# Altium schematic sheet LPCB235 - IO CONNECTOR.SchDoc
size A3; Address1: Unit 4; DocumentNumber: 15; Revision: 2; SheetNumber: 15; SheetTotal: 37; Lockie__PCB_SUB_ASSEMBLY: IO Connector; Lockie__PCB_ASSEMBLY: FCU PCB; Lockie__LDL: LPCB235; Lockie__PCB_DESCRIPTION: Flight Control Unit; PageSetup: Record=PageOptions|CenterHorizontal=True|CenterVertical=True|PrintScale=1.02|XCorrection=1.00|YCorrection=1.00|PrintKind=1|BorderSize=5000000|LeftOffset=0|BottomOffset=0|Orientation=2|PaperLength=4200|PaperWidth=2970|Scale=100|PaperSource=7|PrintQuality=-4|MediaType=1|DitherType=10|PaperKind=A3 (297 x 420 mm)|PrintScaleMode=1
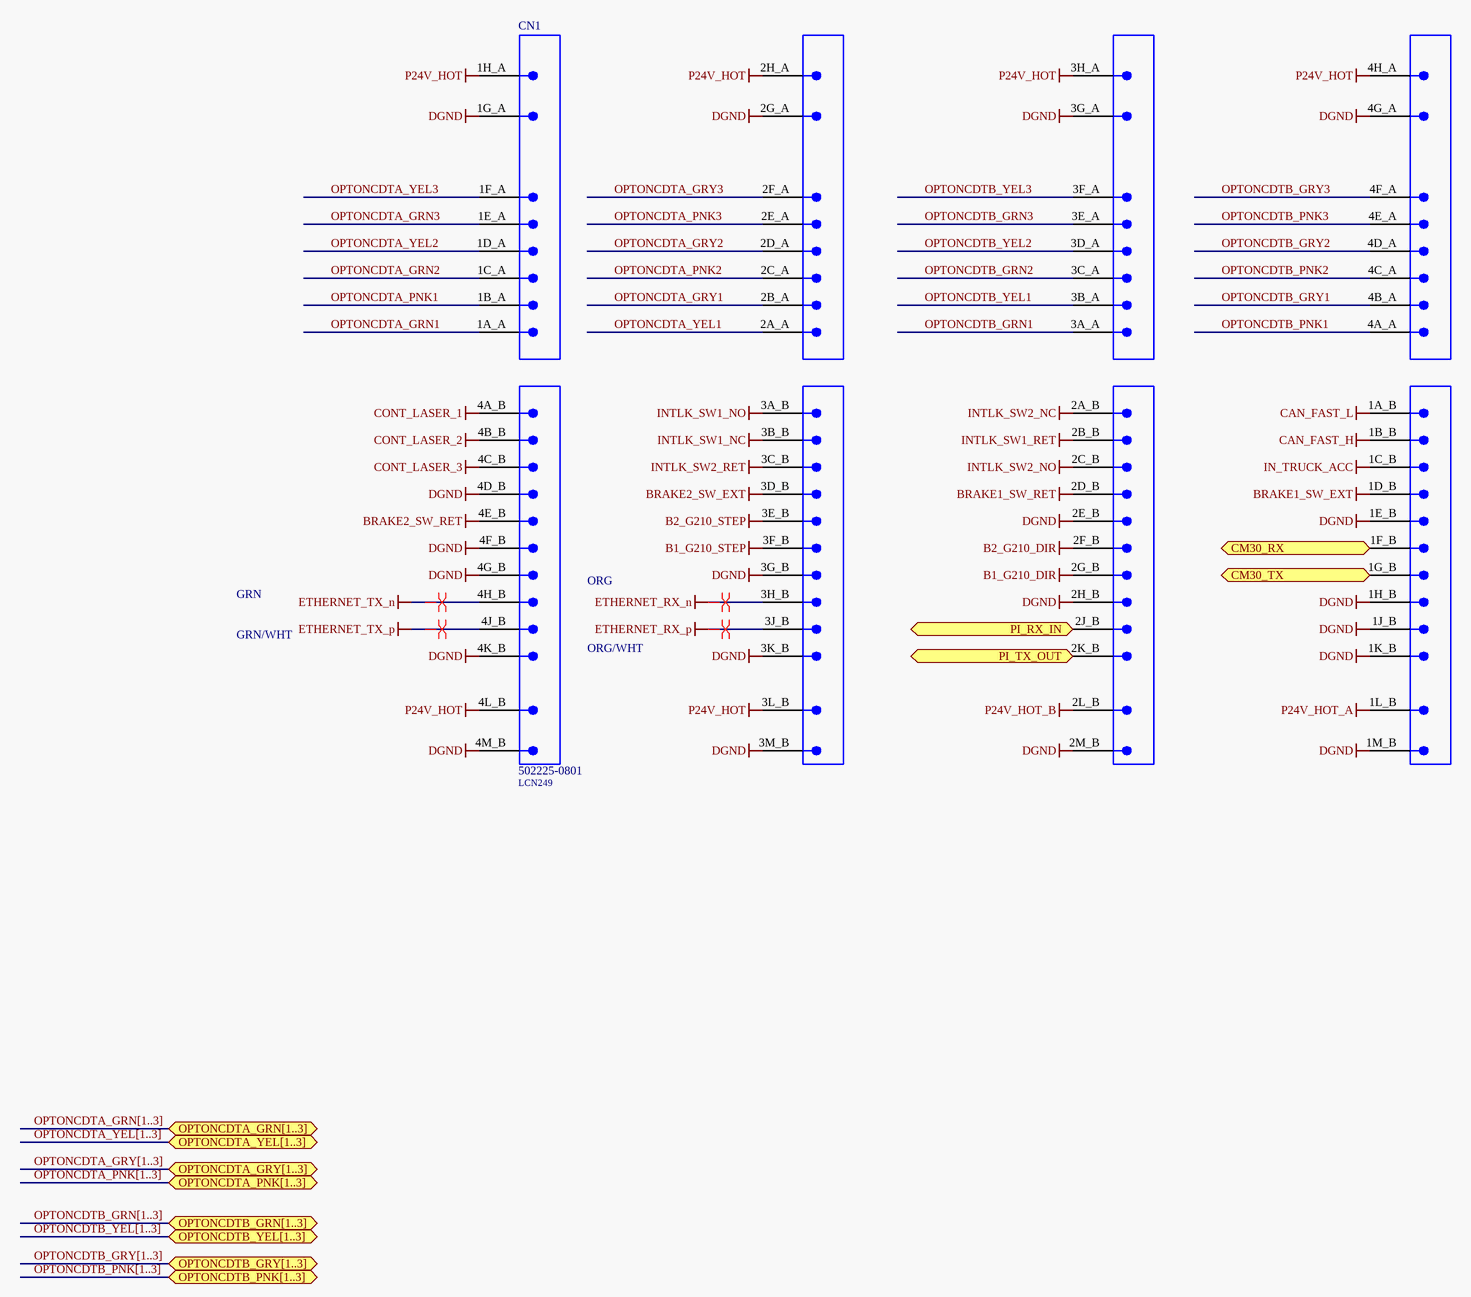
[diagram p0: LPCB235 - IO CONNECTOR.SchDoc]

## Parts
CN1  502225-0801  LDL_NUMBER: LCN249  [502225-0801]

## Ports
CM30_RX (out), CM30_TX (in), OPTONCDTA_GRN[1..3] (bidir), OPTONCDTA_GRY[1..3] (bidir), OPTONCDTA_PNK[1..3] (bidir), OPTONCDTA_YEL[1..3] (bidir), OPTONCDTB_GRN[1..3] (bidir), OPTONCDTB_GRY[1..3] (bidir), OPTONCDTB_PNK[1..3] (bidir), OPTONCDTB_YEL[1..3] (bidir), PI_RX_IN (out), PI_TX_OUT (in)

## Nets
B1_G210_DIR: CN1.2G_B
B1_G210_STEP: CN1.3F_B
B2_G210_DIR: CN1.2F_B
B2_G210_STEP: CN1.3E_B
BRAKE1_SW_EXT: CN1.1D_B
BRAKE1_SW_RET: CN1.2D_B
BRAKE2_SW_EXT: CN1.3D_B
BRAKE2_SW_RET: CN1.4E_B
CAN_FAST_H: CN1.1B_B
CAN_FAST_L: CN1.1A_B
CONT_LASER_1: CN1.4A_B
CONT_LASER_2: CN1.4B_B
CONT_LASER_3: CN1.4C_B
DGND: CN1.1E_B CN1.1G_A(1G) CN1.1H_B CN1.1J_B CN1.1K_B CN1.1M_B CN1.2E_B CN1.2G_A(2G) CN1.2H_B CN1.2M_B CN1.3G_A(3G) CN1.3G_B CN1.3K_B CN1.3M_B CN1.4D_B CN1.4F_B CN1.4G_A(4G) CN1.4G_B CN1.4K_B CN1.4M_B
ETHERNET_RX_n: CN1.3H_B
ETHERNET_RX_p: CN1.3J_B
ETHERNET_TX_n: CN1.4H_B
ETHERNET_TX_p: CN1.4J_B
IN_TRUCK_ACC: CN1.1C_B
INTLK_SW1_NC: CN1.3B_B
INTLK_SW1_NO: CN1.3A_B
INTLK_SW1_RET: CN1.2B_B
INTLK_SW2_NC: CN1.2A_B
INTLK_SW2_NO: CN1.2C_B
INTLK_SW2_RET: CN1.3C_B
P24V_HOT: CN1.1H_A(1H) CN1.2H_A(2H) CN1.3H_A(3H) CN1.3L_B CN1.4H_A(4H) CN1.4L_B
P24V_HOT_A: CN1.1L_B
P24V_HOT_B: CN1.2L_B
CM30_RX: CN1.1F_B ; port CM30_RX
CM30_TX: CN1.1G_B ; port CM30_TX
OPTONCDTA_GRN1: CN1.1A_A(1A)
OPTONCDTA_GRN2: CN1.1C_A(1C)
OPTONCDTA_GRN3: CN1.1E_A(1E)
OPTONCDTA_GRY1: CN1.2B_A(2B)
OPTONCDTA_GRY2: CN1.2D_A(2D)
OPTONCDTA_GRY3: CN1.2F_A(2F)
OPTONCDTA_PNK1: CN1.1B_A(1B)
OPTONCDTA_PNK2: CN1.2C_A(2C)
OPTONCDTA_PNK3: CN1.2E_A(2E)
OPTONCDTA_YEL1: CN1.2A_A(2A)
OPTONCDTA_YEL2: CN1.1D_A(1D)
OPTONCDTA_YEL3: CN1.1F_A(1F)
OPTONCDTB_GRN1: CN1.3A_A(3A)
OPTONCDTB_GRN2: CN1.3C_A(3C)
OPTONCDTB_GRN3: CN1.3E_A(3E)
OPTONCDTB_GRY1: CN1.4B_A(4B)
OPTONCDTB_GRY2: CN1.4D_A(4D)
OPTONCDTB_GRY3: CN1.4F_A(4F)
OPTONCDTB_PNK1: CN1.4A_A(4A)
OPTONCDTB_PNK2: CN1.4C_A(4C)
OPTONCDTB_PNK3: CN1.4E_A(4E)
OPTONCDTB_YEL1: CN1.3B_A(3B)
OPTONCDTB_YEL2: CN1.3D_A(3D)
OPTONCDTB_YEL3: CN1.3F_A(3F)
PI_RX_IN: CN1.2J_B ; port PI_RX_IN
PI_TX_OUT: CN1.2K_B ; port PI_TX_OUT

## Buses and harness runs
bus OPTONCDTA_GRN[1..3] = port OPTONCDTA_GRN[1..3]
bus OPTONCDTA_GRY[1..3] = port OPTONCDTA_GRY[1..3]
bus OPTONCDTA_PNK[1..3] = port OPTONCDTA_PNK[1..3]
bus OPTONCDTA_YEL[1..3] = port OPTONCDTA_YEL[1..3]
bus OPTONCDTB_GRN[1..3] = port OPTONCDTB_GRN[1..3]
bus OPTONCDTB_GRY[1..3] = port OPTONCDTB_GRY[1..3]
bus OPTONCDTB_PNK[1..3] = port OPTONCDTB_PNK[1..3]
bus OPTONCDTB_YEL[1..3] = port OPTONCDTB_YEL[1..3]

## Layout directives
differential pair: ETHERNET_RX_n, ETHERNET_RX_p, ETHERNET_TX_n, ETHERNET_TX_p

## Notes on the sheet
- GRN/WHT
- GRN
- (near CN1) ORG
- (near CN1) ORG/WHT
- PCB COMPONENT DESCRIPTION
- LDL NUMBER
- Assembly Details
- Size
- Drawing File Name
- Revision
- http://rloop.org
- Scale
- A3
- Sheet Details
- N.T.S
- Sheet:
- Of:

## Library data of the parts
CN1 = 502225-0801: Connector, Molex CMC, Automotive Socket, 80 Circuits, 2 Pockets; FMEDA__FUNCTION_IN_SYSTEM: IO CONNECTOR; FMEDA__CHANNEL: COM; FMEDA__OPERATING__CURRENT_MAX: 0; FMEDA__OPERATING__TEMP_MAX: 50; FMEDA__OPERATING__TEMP_MIN: -20; FMEDA__OPERATING__TEMP_TYP: 27; FMEDA__OPERATING__VOLTAGE_MAX: 16; FMEDA__OPERATING__VOLTAGE_TYP: 12; FMEDA__OPERATING__CURRENT_MIN: 0; FMEDA__OPERATING__CURRENT_TYP: 0; FMEDA__OPERATING__VOLTAGE_MIN: 0